# Altium schematic sheet 05.RK3399 Storage.SchDoc
size A4; SheetNumber: 5; SheetTotal: 10
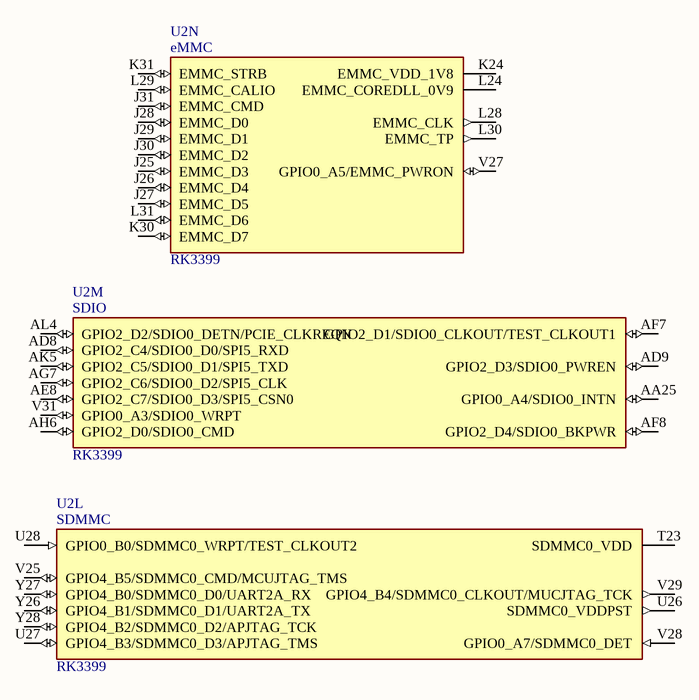
[diagram p0: 05.RK3399 Storage.SchDoc]

## Parts
U2  RK3399  [BGA828C65P31X31_2100X2100X161N]  (parts L,M,N of 32)

## Nets

Not connected (* = marked no-connect by the designer): U2 AA25(GPIO0_A4/SDIO0_INTN) AD8(GPIO2_C4/SDIO0_D0/SPI5_RXD) AD9(GPIO2_D3/SDIO0_PWREN) AE8(GPIO2_C7/SDIO0_D3/SPI5_CSN0) AF7(GPIO2_D1/SDIO0_CLKOUT/TEST_CLKOUT1) AF8(GPIO2_D4/SDIO0_BKPWR) AG7(GPIO2_C6/SDIO0_D2/SPI5_CLK) AH6(GPIO2_D0/SDIO0_CMD) AK5(GPIO2_C5/SDIO0_D1/SPI5_TXD) AL4(GPIO2_D2/SDIO0_DETN/PCIE_CLKREQN) J25(EMMC_D3) J26(EMMC_D4) J27(EMMC_D5) J28(EMMC_D0) J29(EMMC_D1) J30(EMMC_D2) J31(EMMC_CMD) K24(EMMC_VDD_1V8) K30(EMMC_D7) K31(EMMC_STRB) L24(EMMC_COREDLL_0V9) L28(EMMC_CLK) L29(EMMC_CALIO) L30(EMMC_TP) L31(EMMC_D6) T23(SDMMC0_VDD) U26(SDMMC0_VDDPST) U27(GPIO4_B3/SDMMC0_D3/APJTAG_TMS) U28(GPIO0_B0/SDMMC0_WRPT/TEST_CLKOUT2) V25(GPIO4_B5/SDMMC0_CMD/MCUJTAG_TMS) V27(GPIO0_A5/EMMC_PWRON) V28(GPIO0_A7/SDMMC0_DET) V29(GPIO4_B4/SDMMC0_CLKOUT/MUCJTAG_TCK) V31(GPIO0_A3/SDIO0_WRPT) Y26(GPIO4_B1/SDMMC0_D1/UART2A_TX) Y27(GPIO4_B0/SDMMC0_D0/UART2A_RX) Y28(GPIO4_B2/SDMMC0_D2/APJTAG_TCK)

## Notes on the sheet
- (in symbol RK3399, part L) SDMMC
- (in symbol RK3399, part M) SDIO
- (in symbol RK3399, part N) eMMC

## Library data of the parts
U2 = RK3399: RK3399 ROCK Pi 4 Model A 2GB - ARMÂ® CortexÂ®-A53, CortexÂ®-A72 MPU Embedded Evaluation Board; MF: Rockchip; SnapEDA_Link: https://www.snapeda.com/parts/RK3399/Fuzhou+Rockchip+Electronics+Co/view-part/?ref=snap; Package: Seeed Technology; MP: RK3399; Check_prices: https://www.snapeda.com/parts/RK3399/Fuzhou+Rockchip+Electronics+Co/view-part/?ref=eda; Price: None; Value: *; Availability: Not in stock